# EAGLE schematic pcb (EAGLE 8.0.0)
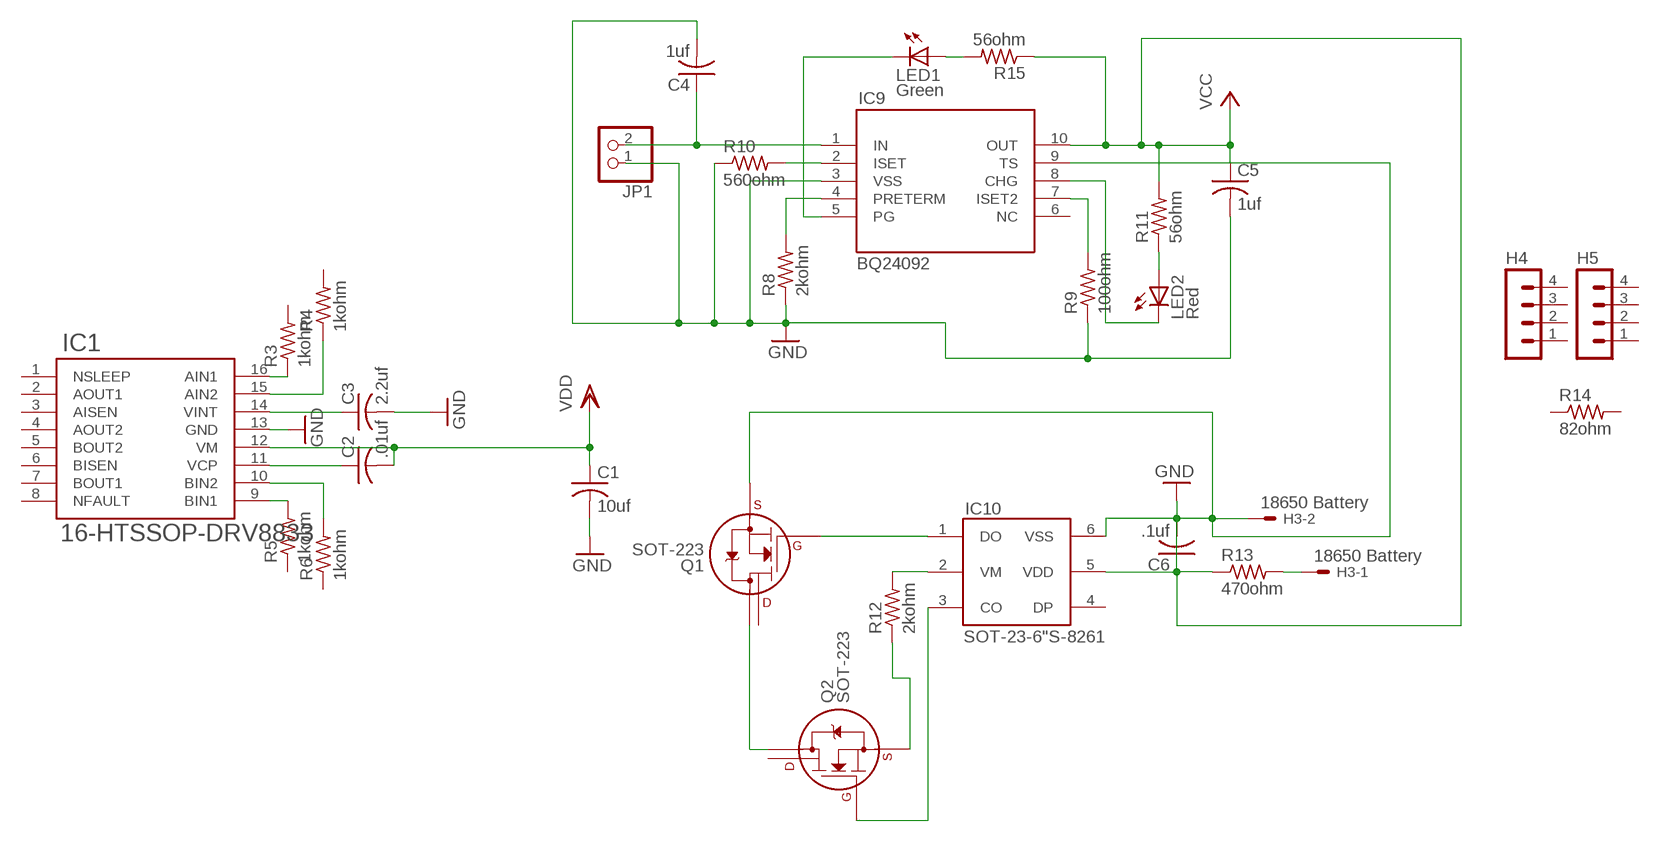
[diagram p0: schematic, sheet 1]

## Parts
C1  10uf  C-USC0805  [C0805]
C2  .01uf  C-USC0805  [C0805]
C3  2.2uf  C-USC1206  [C1206]
C4  1uf  C-USC1206  [C1206]
C5  1uf  C-USC1206  [C1206]
C6  .1uf  C-USC1206  [C1206]
H3  18650 Battery  KK-156-2  [KK-156-2]
H4  MA04-1  [MA04-1]
H5  MA04-1  [MA04-1]
IC1  16-HTSSOP-DRV8833  [TSSOP16E]
IC9  BQ24092  [DFN10-3X3]
IC10  SOT-23-6"S-8261  [SOT23-6]
JP1  PINHD-1X2  [1X02]
LED1  Green  LEDCHIPLED_0805  [CHIPLED_0805]
LED2  Red  LEDCHIPLED_0805  [CHIPLED_0805]
Q1  SOT-223  IRLL014  [SOT-223]
Q2  SOT-223  IRLL014  [SOT-223]
R3  1kohm  R-US_R0805  [R0805]
R4  1kohm  R-US_R0805  [R0805]
R5  1kohm  R-US_R0805  [R0805]
R6  1kohm  R-US_R0805  [R0805]
R8  2kohm  R-US_R1206  [R1206]
R9  100ohm  R-US_R0805  [R0805]
R10  560ohm  R-US_R1206  [R1206]
R11  56ohm  R-US_R1206  [R1206]
R12  2kohm  R-US_R0805  [R0805]
R13  470ohm  R-US_R1206  [R1206]
R14  82ohm  R-US_R1206  [R1206]
R15  56ohm  R-US_R1206  [R1206]

## Nets
GND: C1.2 C3.2 C4.2 C5.1 C5.2 C6.1 C6.2 H3.2 IC1.13(GND) IC9.3(VSS) IC9.9(TS) IC9.10(OUT) IC10.5(VDD) IC10.6(VSS) JP1.1 Q1.3(S) R8.1 R9.1 R10.1 R11.2 R13.1 R15.1 ; supply symbol labelled VCC
N$1: C3.1 IC1.14(VINT)
N$2: IC10.2(VM) R12.2
N$3: C2.1 IC1.11(VCP)
N$4: IC1.16(AIN1) R3.1
N$5: IC1.15(AIN2) R4.1
N$6: IC9.5(PG) LED1.C
N$7: LED1.A R15.2
N$8: IC9.8(CHG) LED2.C
N$9: LED2.A R11.1
N$10: IC9.2(ISET) R10.2
N$11: IC9.4(PRETERM) R8.2
N$12: IC10.1(DO) Q1.1(G)
N$13: C4.1 IC9.1(IN) JP1.2
N$14: IC1.9(BIN1) R5.2
N$15: IC10.3(CO) Q2.1(G)
N$16: Q1.2(D1) Q2.2(D1)
N$17: IC9.7(ISET2) R9.2
N$18: H3.1 R13.2
N$19: Q2.3(S) R12.1
N$20: IC1.10(BIN2) R6.2
VDD: C1.1 C2.2 IC1.12(VM)
Unconnected: H4.1 H4.2 H4.3 H4.4 H5.1 H5.2 H5.3 H5.4 IC1.1(NSLEEP) IC1.2(AOUT1) IC1.3(AISEN) IC1.4(AOUT2) IC1.5(BOUT2) IC1.6(BISEN) IC1.7(BOUT1) IC1.8(NFAULT) IC9.6(NC) IC10.4(DP) Q1.4(D2) Q2.4(D2) R3.2 R4.2 R5.1 R6.1 R14.1 R14.2

## Library data of the parts
C1-C6 = rcl:C-US: CAPACITOR, American symbol
H3 = con-molex:KK-156-2: KK 156 HEADER Source: http://www.molex.com/pdm_docs/sd/026604100_sd.pdf; OC_FARNELL: unknown; OC_NEWARK: unknown
H4 H5 = con-lstb:MA04-1: PIN HEADER; OC_FARNELL: unknown; OC_NEWARK: unknown
IC1 = ECE477_project:16-HTSSOP
IC9 = ECE477_project:BQ24092
IC10 = ECE477_project:SOT-23-6
JP1 = pinhead:PINHD-1X2: PIN HEADER
LED1 LED2 = led:LED: LED OSRAM: - CHIPLED LG R971, LG N971, LY N971, LG Q971, LY Q971, LO R971, LY R971 LH N974, LH R974 LS Q976, LO Q976, LY Q976 LO Q996 - Hyper CHIPLED LW Q18S LB Q993, LB Q99A, LB R99A - SideLED LS A670, LO A670, LY A670, LG A670, LP A670 LB A673, LV A673, LT A673, LW A673 LH A674 LY A675 LS A676, LA A676, LO A676, LY A676, LW A676 LS A679, LY A679, LG A679 - Hyper Micro SIDELED® LS Y876, LA Y876, LO Y876, LY Y876 LT Y87S - SmartLED LW L88C, LW L88S LB L89C, LB L89S, LG L890 LS L89K, LO L89K, LY L89K LS L896, LA L896, LO L896, LY L896 - TOPLED LS T670, LO T670, LY T670, LG T670, LP T670 LSG T670, LSP T670, LSY T670, LOP T670, LYG T670 LG T671, LOG T671, LSG T671 LB T673, LV T673, LT T673, LW T673 LH T674 LS T676, LA T676, LO T676, LY T676, LB T676, LH T676, LSB T676, LW T676 LB T67C, LV T67C, LT T67C, LS T67K, LO T67K, LY T67K, LW E67C LS E67B, LA E67B, LO E67B, LY E67B, LB E67C, LV E67C, LT E67C LW T67C LS T679, LY T679, LG T679 LS T770, LO T770, LY T770, LG T770, LP T770 LB T773, LV T773, LT T773, LW T773 LH T774 LS E675, LA E675, LY E675, LS T675 LS T776, LA T776, LO T776, LY T776, LB T776 LHGB T686 LT T68C, LB T68C - Hyper Mini TOPLED® LB M676 - Mini TOPLED Santana® LG M470 LS M47K, LO M47K, LY M47K Source: http://www.osram.convergy.de LUXEON: - LUMILED® LXK2-PW12-R00, LXK2-PW12-S00, LXK2-PW14-U00, LXK2-PW14-V00 LXK2-PM12-R00, LXK2-PM12-S00, LXK2-PM14-U00 LXK2-PE12-Q00, LXK2-PE12-R00, LXK2-PE12-S00, LXK2-PE14-T00, LXK2-PE14-U00 LXK2-PB12-K00, LXK2-PB12-L00, LXK2-PB12-M00, LXK2-PB14-N00, LXK2-PB14-P00, LXK2-PB14-Q00 LXK2-PR12-L00, LXK2-PR12-M00, LXK2-PR14-Q00, LXK2-PR14-R00 LXK2-PD12-Q00, LXK2-PD12-R00, LXK2-PD12-S00 LXK2-PH12-R00, LXK2-PH12-S00 LXK2-PL12-P00, LXK2-PL12-Q00, LXK2-PL12-R00 Source: www.luxeon.com KINGBRIGHT: KA-3528ASYC Source: www.kingbright.com
Q1 Q2 = transistors:IRLL*: International Rectifier IRLL series N-channel enhancement mode MOSFET HEXFET Power MOSFET SOT-223 Includes body diode
R3-R6 R8-R15 = rcl:R-US_: RESISTOR, American symbol